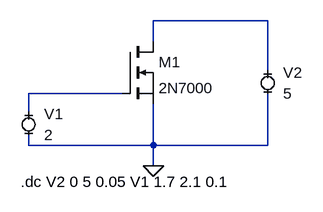
[diagram p0: schematic Draft2.asc]
Draft2.asc, the LTspice schematic file:
Version 4
SHEET 1 880 680
WIRE 352 32 176 32
WIRE 176 64 176 32
WIRE 352 112 352 32
WIRE 128 144 -16 144
WIRE -16 176 -16 144
WIRE -16 224 -16 208
WIRE 176 224 176 160
WIRE 176 224 -16 224
WIRE 352 224 352 144
WIRE 352 224 176 224
WIRE 176 256 176 224
FLAG 176 256 0
SYMBOL MiniSyms4\\voltage- -16 192 R0
WINDOW 123 0 0 Left 0
WINDOW 39 0 0 Left 0
SYMATTR InstName V1
SYMATTR Value 2
SYMBOL nmos 128 64 R0
SYMATTR InstName M1
SYMATTR Value 2N7000
SYMBOL MiniSyms4\\voltage- 352 128 R0
WINDOW 123 0 0 Left 0
WINDOW 39 0 0 Left 0
SYMATTR InstName V2
SYMATTR Value 5
TEXT -28 280 Left 2 !.dc V2 0 5 0.05 V1 1.7 2.1 0.1

The netlist it stands for:
* Draft2.asc
V1 N002 0 2
M1 N001 N002 0 0 2N7000
V2 N001 0 5
.model NMOS NMOS
.model PMOS PMOS
.lib standard.mos
.dc V2 0 5 0.05 V1 1.7 2.1 0.1
.backanno
.end